# Altium schematic sheet power.SchDoc
size 381 x 241 mm; SheetNumber: 2; SheetTotal: 5
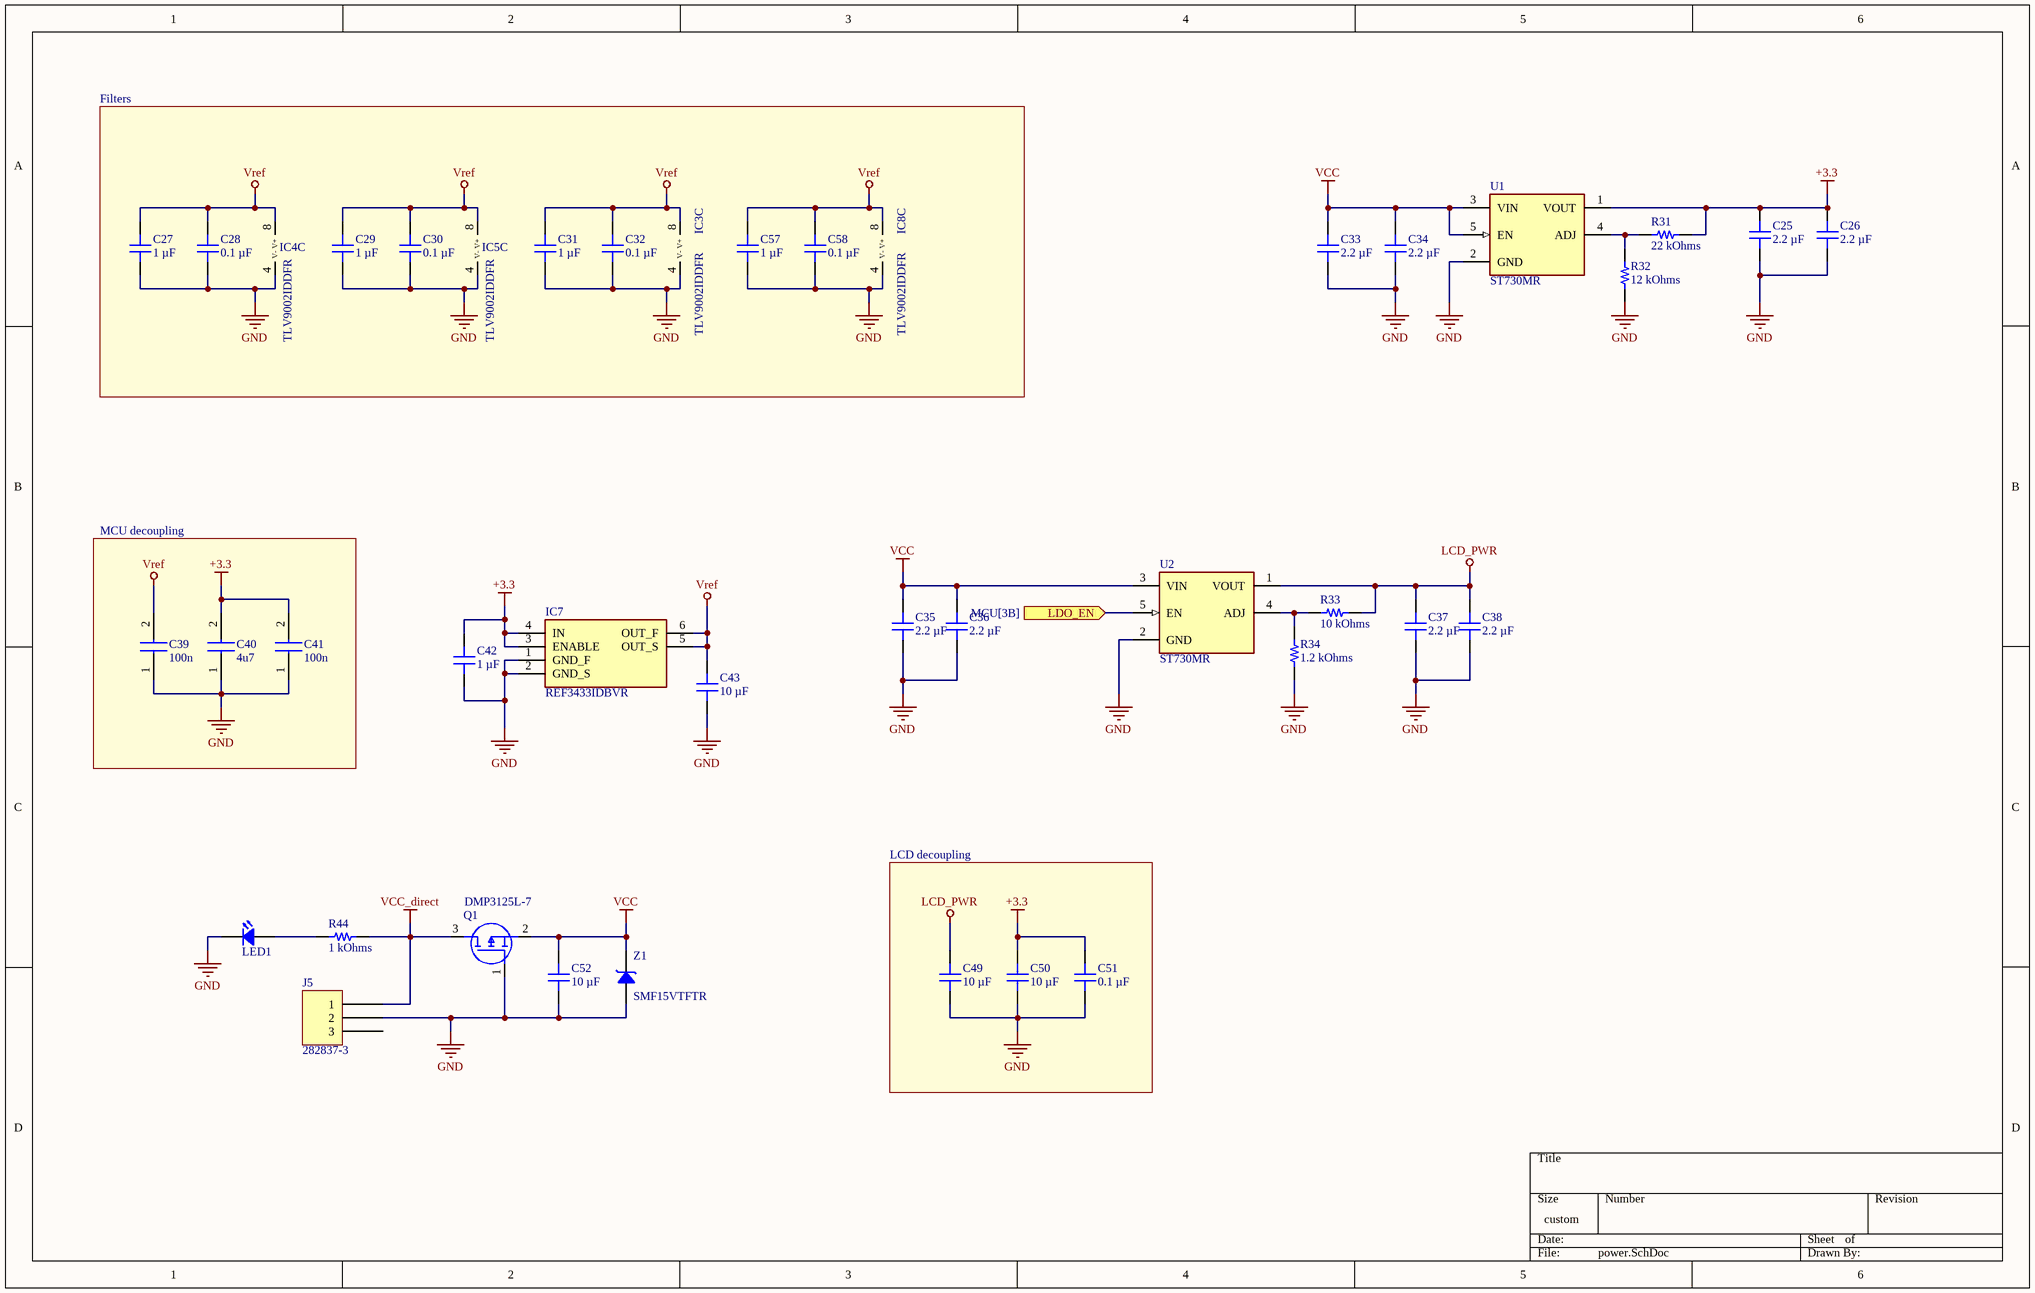
[diagram p0: power.SchDoc]

## Parts
C25  2.2 µF  [CAP 1206_3216 - 0.8MM]
C26  2.2 µF  [CAP 1206_3216 - 0.8MM]
C27  1 µF  [CAP 1206_3216 - 0.8MM]
C28  0.1 µF  [CAP 1206_3216 - 0.8MM]
C29  1 µF  [CAP 1206_3216 - 0.8MM]
C30  0.1 µF  [CAP 1206_3216 - 0.8MM]
C31  1 µF  [CAP 1206_3216 - 0.8MM]
C32  0.1 µF  [CAP 1206_3216 - 0.8MM]
C33  2.2 µF  [CAP 1206_3216 - 0.8MM]
C34  2.2 µF  [CAP 1206_3216 - 0.8MM]
C35  2.2 µF  [CAP 1206_3216 - 0.8MM]
C36  2.2 µF  [CAP 1206_3216 - 0.8MM]
C37  2.2 µF  [CAP 1206_3216 - 0.8MM]
C38  2.2 µF  [CAP 1206_3216 - 0.8MM]
C39  100n  [C0805]
C40  4u7  [C0805]
C41  100n  [C0805]
C42  1 µF  [CAP 1206_3216 - 0.8MM]
C43  10 µF  [CAP 1206_3216 - 0.8MM]
C49  10 µF  [CAP 1206_3216 - 0.8MM]
C50  10 µF  [CAP 1206_3216 - 0.8MM]
C51  0.1 µF  [CAP 1206_3216 - 0.8MM]
C52  10 µF  [CAP 1206_3216 - 0.8MM]
C57  1 µF  [CAP 1206_3216 - 0.8MM]
C58  0.1 µF  [CAP 1206_3216 - 0.8MM]
IC3  TLV9002IDDFR  [SOT65P280X110-8N]  (part C of 3)
IC4  TLV9002IDDFR  [SOT65P280X110-8N]  (part C of 3)
IC5  TLV9002IDDFR  [SOT65P280X110-8N]  (part C of 3)
IC7  REF3433IDBVR  [SOT95P280X145-6N]
IC8  TLV9002IDDFR  [SOT65P280X110-8N]  (part C of 3)
J5  282837-3  [TE 282837-3]
LED1  KR_EELP41.22-Q1S1-36-A8J8-020-R18  [KREELP4122Q1S136A8J8020R18]  (value not drawn)
Q1  DMP3125L-7  [SOT96P240X110-3N]
R31  22 kOhms  [YAGEO RES 1206_3216]
R32  12 kOhms  [YAGEO RES 1206_3216]
R33  10 kOhms  [YAGEO RES 1206_3216]
R34  1.2 kOhms  [YAGEO RES 1206_3216]
R44  1 kOhms  [YAGEO RES 1206_3216]
U1  ST730MR  [FP-UJ-5-IPC_B]
U2  ST730MR  [FP-UJ-5-IPC_B]
Z1  SMF15VTFTR  [SMF15VTFTR]

## Blocks framed on the sheet
Filters: C27-C32 C57 C58 IC3-IC5 IC8
MCU decoupling: C39-C41
LCD decoupling: C49-C51

## Ports
LDO_EN (in, see MCU[3B])

## Nets
+3.3: C25.2 C26.2 C40.2 C41.2 C42.2 C50.2 C51.2 IC7.3(ENABLE) IC7.4(IN) R31.2 U1.1(VOUT)
GND: C25.1 C26.1 C27.1 C28.1 C29.1 C30.1 C31.1 C32.1 C33.1 C34.1 C35.1 C36.1 C37.1 C38.1 C39.1 C40.1 C41.1 C42.1 C43.1 C49.1 C50.1 C51.1 C52.1 C57.1 C58.1 IC3.4(V-) IC4.4(V-) IC5.4(V-) IC7.1(GND_F) IC7.2(GND_S) IC8.4(V-) J5.2 LED1.1(K) Q1.1(G) R32.2 R34.2 U1.2(GND) U2.2(GND) Z1.2
LCD_PWR: C37.2 C38.2 C49.2 R33.2 U2.1(VOUT)
VCC: C33.2 C34.2 C35.2 C36.2 C52.2 Q1.2(S) U1.3(VIN) U1.5(EN) U2.3(VIN) Z1.1
VCC_direct: J5.1 Q1.3(D) R44.1
Vref: C27.2 C28.2 C29.2 C30.2 C31.2 C32.2 C39.2 C43.2 C57.2 C58.2 IC3.8(V+) IC4.8(V+) IC5.8(V+) IC7.5(OUT_S) IC7.6(OUT_F) IC8.8(V+)
LDO_EN: U2.5(EN) ; port LDO_EN
NetLED1_2: LED1.2(A) R44.2
NetR31_1: R31.1 R32.1 U1.4(ADJ)
NetR33_1: R33.1 R34.1 U2.4(ADJ)

Not connected (* = marked no-connect by the designer): J5 3

## Library data of the parts
C25 C26 C33-C38 = 885382208001: CAP CER 2.2UF 25V X7R 1206; manufacturer: Würth Elektronik; Tolerance: ±10%; Part Number: 885382208001; Capacitance: 2.2 µF; Applications: Boardflex Sensitive; componentlink2description: DigiKey Link; componentlink2url: https://www.digikey.com/en/products/detail/würth-elektronik/885382208001/9816354; Device Package: 1206 (3216 Metric); Features: Soft Termination; lastupdated: 6/4/2024 19:10:38; Lifecycle Status: Active; Minimum Order: 1; Mounting Type: Surface Mount, MLCC; Operating Temperature: -55°C ~ 125°C; Package / Case: 1206 (3216 Metric); packaging: TapeAndReel; partid: 45904; Part Status: Active; price: 0.35; series: WCAP-CSST; Size / Dimension: 0.126" L x 0.063" W (3.20mm x 1.60mm); Supplier 1: DigiKey; Supplier Part Number 1: 732-13199-1-ND; Temperature Coefficient: X7R; Thickness (Max): 0.083" (2.10mm); value: 2.2 µF; Voltage - Rated: 25V
C27 C29 C31 C42 C57 = 885012208093: CAP CER 1UF 50V X7R 1206; manufacturer: Würth Elektronik; Tolerance: ±10%; Part Number: 885012208093; Capacitance: 1 µF; Applications: General Purpose; componentlink1description: Datasheet; componentlink1url: https://katalog.we-online.de/pbs/datasheet/885012208093.pdf; componentlink2description: DigiKey Link; componentlink2url: https://www.digikey.com/en/products/detail/würth-elektronik/885012208093/5453432; Device Package: 1206 (3216 Metric); lastupdated: 6/4/2024 19:10:33; Lifecycle Status: Active; Minimum Order: 1; Mounting Type: Surface Mount, MLCC; Operating Temperature: -55°C ~ 125°C; Package / Case: 1206 (3216 Metric); packaging: TapeAndReel; partid: 39665; Part Status: Active; price: 0.10; series: WCAP-CSGP; Size / Dimension: 0.126" L x 0.063" W (3.20mm x 1.60mm); Supplier 1: DigiKey; Supplier Part Number 1: 732-7577-1-ND; Temperature Coefficient: X7R; Thickness (Max): 0.075" (1.90mm); value: 1 µF; Voltage - Rated: 50V
C28 C30 C32 C51 C58 = 885012208087: CAP CER 0.1UF 50V X7R 1206; manufacturer: Würth Elektronik; Tolerance: ±10%; Part Number: 885012208087; Capacitance: 0.1 µF; Applications: General Purpose; componentlink1description: Datasheet; componentlink1url: https://katalog.we-online.de/pbs/datasheet/885012208087.pdf; componentlink2description: DigiKey Link; componentlink2url: https://www.digikey.com/en/products/detail/würth-elektronik/885012208087/5453982; Device Package: 1206 (3216 Metric); lastupdated: 6/4/2024 19:10:27; Lifecycle Status: Active; Minimum Order: 1; Mounting Type: Surface Mount, MLCC; Operating Temperature: -55°C ~ 125°C; Package / Case: 1206 (3216 Metric); packaging: TapeAndReel; partid: 20879; Part Status: Active; price: 0.06; series: WCAP-CSGP; Size / Dimension: 0.126" L x 0.063" W (3.20mm x 1.60mm); Supplier 1: DigiKey; Supplier Part Number 1: 732-8127-1-ND; Temperature Coefficient: X7R; Thickness (Max): 0.035" (0.90mm); value: 0.1 µF; Voltage - Rated: 50V
C39 C41 = C0805C104K3RACTU: Capacitor; Manufacturer_Name: KEMET; Datasheet Link: https://content.kemet.com/datasheets/KEM_C1002_X7R_SMD.pdf; Height: 1.1mm; Manufacturer_Part_Number: C0805C104K3RACTU; Mouser Part Number: 80-C0805C104K3R; Mouser Price/Stock: https://www.mouser.co.uk/ProductDetail/KEMET/C0805C104K3RACTU?qs=zZwvocWqSRjmUvfNxkIN%2Fg%3D%3D; Arrow Part Number: C0805C104K3RACTU; Arrow Price/Stock: https://www.arrow.com/en/products/c0805c104k3ractu/kemet-corporation
C40 = C0805C475K9PAC: Capacitor; Manufacturer_Name: KEMET; Datasheet Link: https://componentsearchengine.com/Datasheets/2/C0805C475K8RACTU.pdf; Height: 1.4mm; Manufacturer_Part_Number: C0805C475K9PAC; Mouser Part Number: 80-C0805C475K9PAC; Mouser Price/Stock: https://www.mouser.co.uk/ProductDetail/KEMET/C0805C475K9PAC?qs=AHS6Mz2dKxNT7foClPNFpA%3D%3D; Arrow Part Number: C0805C475K9PAC; Arrow Price/Stock: https://www.arrow.com/en/products/c0805c475k9pac/kemet-corporation?region=nac
C43 C49 C50 C52 = 885012208069: CAP CER 10UF 25V X7R 1206; manufacturer: Würth Elektronik; Tolerance: ±10%; Part Number: 885012208069; Capacitance: 10 µF; Applications: General Purpose; componentlink1description: Datasheet; componentlink1url: https://katalog.we-online.de/pbs/datasheet/885012208069.pdf; componentlink2description: DigiKey Link; componentlink2url: https://www.digikey.com/en/products/detail/würth-elektronik/885012208069/5453429; Device Package: 1206 (3216 Metric); lastupdated: 6/4/2024 19:10:32; Lifecycle Status: Active; Minimum Order: 1; Mounting Type: Surface Mount, MLCC; Operating Temperature: -55°C ~ 125°C; Package / Case: 1206 (3216 Metric); packaging: TapeAndReel; partid: 43199; Part Status: Active; price: 0.40; series: WCAP-CSGP; Size / Dimension: 0.126" L x 0.063" W (3.20mm x 1.60mm); Supplier 1: DigiKey; Supplier Part Number 1: 732-7574-1-ND; Temperature Coefficient: X7R; Thickness (Max): 0.075" (1.90mm); value: 10 µF; Voltage - Rated: 25V
IC3-IC5 IC8 = TLV9002IDDFR: Integrated Circuit; Manufacturer_Name: Texas Instruments; Datasheet Link: https://www.ti.com/lit/gpn/TLV9002; Height: 1.1mm; Manufacturer_Part_Number: TLV9002IDDFR; Mouser Part Number: 595-TLV9002IDDFR; Mouser Price/Stock: https://www.mouser.co.uk/ProductDetail/Texas-Instruments/TLV9002IDDFR?qs=mAH9sUMRCtuVJ6NmNV%252Bgrw%3D%3D; Arrow Part Number: TLV9002IDDFR; Arrow Price/Stock: https://www.arrow.com/en/products/tlv9002iddfr/texas-instruments?utm_currency=USD&region=nac
IC7 = REF3433IDBVR: Integrated Circuit; Manufacturer_Name: Texas Instruments; Datasheet Link: http://www.ti.com/lit/ds/symlink/ref3433.pdf; Height: 1.45mm; Manufacturer_Part_Number: REF3433IDBVR; Mouser Part Number: 595-REF3433IDBVR; Mouser Price/Stock: https://www.mouser.co.uk/ProductDetail/Texas-Instruments/REF3433IDBVR?qs=W0yvOO0ixfGBJPqcMgjPbw%3D%3D; Arrow Part Number: REF3433IDBVR; Arrow Price/Stock: https://www.arrow.com/en/products/ref3433idbvr/texas-instruments?utm_currency=USD&region=nac
J5 = 282837-3: TERM BLK 3P SIDE ENT 5.08MM PCB; Manufacturer: TE Connectivity AMP Connectors; Current: 13.5 A; Mating Orientation: Horizontal with Board; Number of Levels: 1; Pitch: 0.200" (5.08mm); Positions Per Level: 3; Voltage: 300 V; Wire Gauge: 16-28 AWG; Wire Termination: Screw - Rising Cage Clamp; Part Number: 282837-3; Color: Green; ComponentLink1Description: Datasheet; ComponentLink1URL: https://www.te.com/commerce/DocumentDelivery/DDEController?Action=srchrtrv&DocNm=282837&DocType=Customer+Drawing&DocLang=English; ComponentLink2Description: DigiKey Link; ComponentLink2URL: https://www.digikey.com/en/products/detail/te-connectivity-amp-connectors/282837-3/2187974; Features: Interlocking (Side); LastUpdated: 6/21/2022 15:00:39; Lifecycle Status: Active; Minimum Order: 1; Mounting Type: Through Hole; Packaging: Tray; Part Status: Active; Price: 0.47; Series: Buchanan; Supplier 1: DigiKey; Supplier Part Number 1: A113321-ND
LED1 = KR_EELP41.22-Q1S1-36-A8J8-020-R18: LED; Manufacturer_Name: ams OSRAM; Manufacturer_Part_Number: KR EELP41.22-Q1S1-36-A8J8-020-R18; Datasheet Link: https://look.ams-osram.com/m/7eda7e8e2ca21691/original/KR-EELP41-22.pdf; Height: 0.5mm; Mouser Part Number: 720-P412Q1S136A8J802; Mouser Price/Stock: https://www.mouser.co.uk/ProductDetail/ams-OSRAM/KR-EELP41.22-Q1S1-36-A8J8-020-R18?qs=ZcfC38r4PouTxNZSRl%252Bn6g%3D%3D
Q1 = DMP3125L-7: MOSFET (P-Channel); Manufacturer_Name: Diodes Incorporated; Datasheet Link: https://www.diodes.com//assets/Datasheets/DMP3125L.pdf; Height: 1.1mm; Manufacturer_Part_Number: DMP3125L-7; Mouser Part Number: 621-DMP3125L-7; Mouser Price/Stock: https://www.mouser.co.uk/ProductDetail/Diodes-Incorporated/DMP3125L-7?qs=W0yvOO0ixfH8ma8MdHfXQA%3D%3D; Arrow Part Number: DMP3125L-7; Arrow Price/Stock: https://www.arrow.com/en/products/dmp3125l-7/diodes-incorporated?region=nac
R31 = RT1206FRE0722KL: RES SMD 22K OHM 1% 1/4W 1206; Manufacturer: Yageo; Power (Watts): 0.25W, 1/4W; Temperature Coefficient: ±50ppm/°C; Part Number: RT1206FRE0722KL; ComponentLink1Description: Datasheet; ComponentLink1URL: https://www.yageo.com/upload/media/product/productsearch/datasheet/rchip/PYu-RT_1-to-0.01_RoHS_L_12.pdf; ComponentLink2Description: DigiKey Link; ComponentLink2URL: https://www.digikey.com/en/products/detail/yageo/RT1206FRE0722KL/1083042; Composition: Thin Film; Device Package: 1206 (3216 Metric); Height - Seated (Max): 0.026" (0.65mm); LastUpdated: 7/25/2024 09:21:19; Lifecycle Status: Active; Minimum Order: 1; Number of Terminations: 2; Operating Temperature: -55°C ~ 155°C; Package / Case: 1206 (3216 Metric); Packaging: TapeAndReel; PartId: 69172; Price: 0.01; Resistance: 22 kOhms; Series: RT; Size / Dimension: 0.122" L x 0.063" W (3.10mm x 1.60mm); Supplier 1: DigiKey; Supplier Part Number 1: 13-RT1206FRE0722KLCT-ND; Supplier Device Package: 1206; Tolerance: ±1%; Value: 22 kOhms; Part Status: Active
R32 = RT1206FRE0712KL: RES SMD 12K OHM 1% 1/4W 1206; Manufacturer: Yageo; Power (Watts): 0.25W, 1/4W; Temperature Coefficient: ±50ppm/°C; Part Number: RT1206FRE0712KL; ComponentLink1Description: Datasheet; ComponentLink1URL: https://www.yageo.com/upload/media/product/productsearch/datasheet/rchip/PYu-RT_1-to-0.01_RoHS_L_12.pdf; ComponentLink2Description: DigiKey Link; ComponentLink2URL: https://www.digikey.com/en/products/detail/yageo/RT1206FRE0712KL/1082900; Composition: Thin Film; Device Package: 1206 (3216 Metric); Height - Seated (Max): 0.026" (0.65mm); LastUpdated: 7/25/2024 09:21:22; Lifecycle Status: Active; Minimum Order: 1; Number of Terminations: 2; Operating Temperature: -55°C ~ 155°C; Package / Case: 1206 (3216 Metric); Packaging: TapeAndReel; PartId: 58377; Part Status: Active; Price: 0.01; Resistance: 12 kOhms; Series: RT; Size / Dimension: 0.122" L x 0.063" W (3.10mm x 1.60mm); Supplier 1: DigiKey; Supplier Part Number 1: 13-RT1206FRE0712KLCT-ND; Supplier Device Package: 1206; Tolerance: ±1%; Value: 12 kOhms
R33 = RT1206FRE0710KL: RES SMD 10K OHM 1% 1/4W 1206; Manufacturer: Yageo; Power (Watts): 0.25W, 1/4W; Temperature Coefficient: ±50ppm/°C; Part Number: RT1206FRE0710KL; ComponentLink1Description: Datasheet; ComponentLink1URL: https://www.yageo.com/upload/media/product/productsearch/datasheet/rchip/PYu-RT_1-to-0.01_RoHS_L_11.pdf; ComponentLink2Description: DigiKey Link; ComponentLink2URL: https://www.digikey.com/en/products/detail/yageo/RT1206FRE0710KL/1082868; Composition: Thin Film; Device Package: 1206 (3216 Metric); Height - Seated (Max): 0.026" (0.65mm); LastUpdated: 7/25/2024 09:21:28; Lifecycle Status: Active; Minimum Order: 1; Number of Terminations: 2; Operating Temperature: -55°C ~ 155°C; Package / Case: 1206 (3216 Metric); Packaging: TapeAndReel; PartId: 38903; Part Status: Active; Price: 0.01; Resistance: 10 kOhms; Series: RT; Size / Dimension: 0.122" L x 0.063" W (3.10mm x 1.60mm); Supplier 1: DigiKey; Supplier Part Number 1: YAG1242CT-ND; Supplier Device Package: 1206; Tolerance: ±1%; Value: 10 kOhms
R34 = RT1206FRE071K2L: RES SMD 1.2K OHM 1% 1/4W 1206; Manufacturer: Yageo; Power (Watts): 0.25W, 1/4W; Temperature Coefficient: ±50ppm/°C; Part Number: RT1206FRE071K2L; ComponentLink1Description: Datasheet; ComponentLink1URL: https://www.yageo.com/upload/media/product/productsearch/datasheet/rchip/PYu-RT_1-to-0.01_RoHS_L_12.pdf; ComponentLink2Description: DigiKey Link; ComponentLink2URL: https://www.digikey.com/en/products/detail/yageo/RT1206FRE071K2L/1082995; Composition: Thin Film; Device Package: 1206 (3216 Metric); Height - Seated (Max): 0.026" (0.65mm); LastUpdated: 7/25/2024 09:21:22; Lifecycle Status: Active; Minimum Order: 1; Number of Terminations: 2; Operating Temperature: -55°C ~ 155°C; Package / Case: 1206 (3216 Metric); Packaging: TapeAndReel; PartId: 58383; Part Status: Active; Price: 0.01; Resistance: 1.2 kOhms; Series: RT; Size / Dimension: 0.122" L x 0.063" W (3.10mm x 1.60mm); Supplier 1: DigiKey; Supplier Part Number 1: 13-RT1206FRE071K2LCT-ND; Supplier Device Package: 1206; Tolerance: ±1%; Value: 1.2 kOhms
R44 = RT1206FRE071KL: RES SMD 1K OHM 1% 1/4W 1206; Manufacturer: Yageo; Power (Watts): 0.25W, 1/4W; Temperature Coefficient: ±50ppm/°C; Part Number: RT1206FRE071KL; ComponentLink1Description: Datasheet; ComponentLink1URL: https://www.yageo.com/upload/media/product/productsearch/datasheet/rchip/PYu-RT_1-to-0.01_RoHS_L_11.pdf; ComponentLink2Description: DigiKey Link; ComponentLink2URL: https://www.digikey.com/en/products/detail/yageo/RT1206FRE071KL/1083016; Composition: Thin Film; Device Package: 1206 (3216 Metric); Height - Seated (Max): 0.026" (0.65mm); LastUpdated: 7/25/2024 09:21:27; Lifecycle Status: Active; Minimum Order: 1; Number of Terminations: 2; Operating Temperature: -55°C ~ 155°C; Package / Case: 1206 (3216 Metric); Packaging: TapeAndReel; PartId: 40465; Part Status: Active; Price: 0.01; Resistance: 1 kOhms; Series: RT; Size / Dimension: 0.122" L x 0.063" W (3.10mm x 1.60mm); Supplier 1: DigiKey; Supplier Part Number 1: YAG3366CT-ND; Supplier Device Package: 1206; Tolerance: ±1%; Value: 1 kOhms
Z1 = SMF15VTFTR: Zener Diode; Manufacturer_Name: ROHM Semiconductor; Datasheet Link: https://fscdn.rohm.com/en/products/databook/datasheet/discrete/diode/zener/smf15vtftr-e.pdf; Height: 0.9mm; Manufacturer_Part_Number: SMF15VTFTR; Mouser Part Number: 755-SMF15VTFTR; Mouser Price/Stock: https://www.mouser.co.uk/ProductDetail/ROHM-Semiconductor/SMF15VTFTR?qs=HXFqYaX1Q2wU8NS9uLe0xg%3D%3D